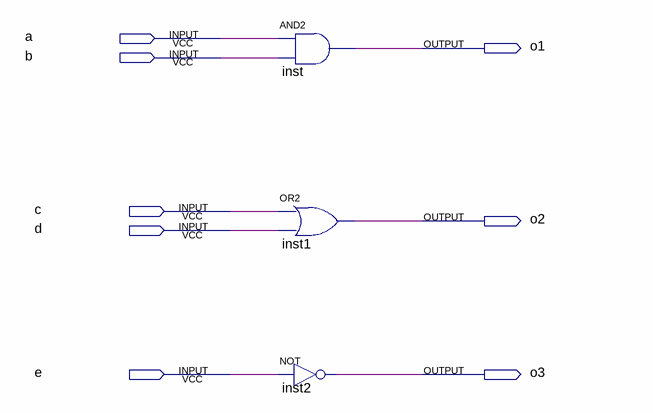
[diagram p0: schematic sheet]
// Quartus schematic lab1.bdf as structural Verilog: 3 symbols, 8 pins
module lab1 (
  input  a,
  input  b,
  input  c,
  input  d,
  input  e,
  output o1,
  output o2,
  output o3
);

  and inst (o1, a, b);
  or inst1 (o2, c, d);
  not inst2 (o3, e);
endmodule
